# EAGLE design main1-rev-b (EAGLE 8.0.0)
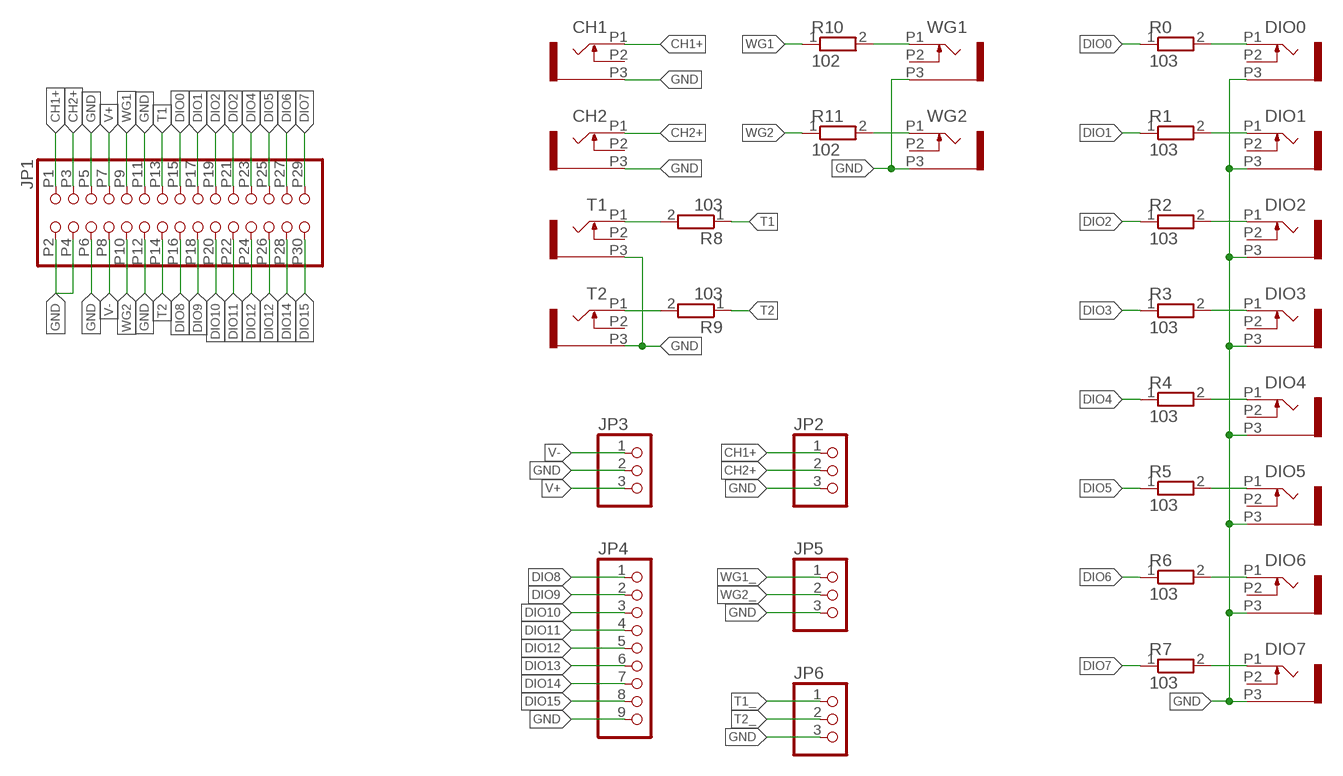
[diagram p0: schematic, sheet 1]

## Parts
CH1  THONKICONN  [WQP-PJ301M-12_JACK]
CH2  THONKICONN  [WQP-PJ301M-12_JACK]
DIO0  THONKICONN  [WQP-PJ301M-12_JACK]
DIO1  THONKICONN  [WQP-PJ301M-12_JACK]
DIO2  THONKICONN  [WQP-PJ301M-12_JACK]
DIO3  THONKICONN  [WQP-PJ301M-12_JACK]
DIO4  THONKICONN  [WQP-PJ301M-12_JACK]
DIO5  THONKICONN  [WQP-PJ301M-12_JACK]
DIO6  THONKICONN  [WQP-PJ301M-12_JACK]
DIO7  THONKICONN  [WQP-PJ301M-12_JACK]
JP1  PINHD-2X15  [2X15/EDGE]
JP2  PINHD-1X3/OCT  [1X03/OCT]
JP3  PINHD-1X3/OCT  [1X03/OCT]
JP4  PINHD-1X9/OCT  [1X09/OCT]
JP5  PINHD-1X3/OCT  [1X03/OCT]
JP6  PINHD-1X3/OCT  [1X03/OCT]
R0  103  R-EU_R0603  [R0603]
R1  103  R-EU_R0603  [R0603]
R2  103  R-EU_R0603  [R0603]
R3  103  R-EU_R0603  [R0603]
R4  103  R-EU_R0603  [R0603]
R5  103  R-EU_R0603  [R0603]
R6  103  R-EU_R0603  [R0603]
R7  103  R-EU_R0603  [R0603]
R8  103  R-EU_R0603  [R0603]
R9  103  R-EU_R0603  [R0603]
R10  102  R-EU_R0603  [R0603]
R11  102  R-EU_R0603  [R0603]
T1  THONKICONN  [WQP-PJ301M-12_JACK]
T2  THONKICONN  [WQP-PJ301M-12_JACK]
WG1  THONKICONN  [WQP-PJ301M-12_JACK]
WG2  THONKICONN  [WQP-PJ301M-12_JACK]

## Nets
CH1+: CH1.P1 JP1.P1 JP2.1
CH2+: CH2.P1 JP1.P3 JP2.2
DIO0: JP1.P15 R0.1
DIO0_: DIO0.P1 R0.2
DIO1: JP1.P17 R1.1
DIO1_: DIO1.P1 R1.2
DIO2: JP1.P19 R2.1
DIO2_: DIO2.P1 R2.2
DIO3: JP1.P21 R3.1
DIO3_: DIO3.P1 R3.2
DIO4: JP1.P23 R4.1
DIO4_: DIO4.P1 R4.2
DIO5: JP1.P25 R5.1
DIO5_: DIO5.P1 R5.2
DIO6: JP1.P27 R6.1
DIO6_: DIO6.P1 R6.2
DIO7: JP1.P29 R7.1
DIO7_: DIO7.P1 R7.2
DIO8: JP1.P16 JP4.1
DIO9: JP1.P18 JP4.2
DIO10: JP1.P20 JP4.3
DIO11: JP1.P22 JP4.4
DIO12: JP1.P24 JP4.5
DIO13: JP1.P26 JP4.6
DIO14: JP1.P28 JP4.7
DIO15: JP1.P30 JP4.8
GND: CH1.P3 CH2.P3 DIO0.P3 DIO1.P3 DIO2.P3 DIO3.P3 DIO4.P3 DIO5.P3 DIO6.P3 DIO7.P3 JP1.P2 JP1.P4 JP1.P5 JP1.P6 JP1.P11 JP1.P12 JP2.3 JP3.2 JP4.9 JP5.3 JP6.3 T1.P3 T2.P3 WG1.P3 WG2.P3
T1: JP1.P13 R8.1
T1_: JP6.1 R8.2 T1.P1
T2: JP1.P14 R9.1
T2_: JP6.2 R9.2 T2.P1
V+: JP1.P7 JP3.3
V-: JP1.P8 JP3.1
WG1: JP1.P9 R10.1
WG1_: JP5.1 R10.2 WG1.P1
WG2: JP1.P10 R11.1
WG2_: JP5.2 R11.2 WG2.P1
Unconnected: CH1.P2 CH2.P2 DIO0.P2 DIO1.P2 DIO2.P2 DIO3.P2 DIO4.P2 DIO5.P2 DIO6.P2 DIO7.P2 T1.P2 T2.P2 WG1.P2 WG2.P2

## Library data of the parts
CH1 CH2 DIO0 DIO1-DIO7 T1 T2 WG1 WG2 = _JC:THONKICONN
JP1 = _JC:PINHD-2X15: PIN HEADER
JP2 JP3 JP5 JP6 = _JC:PINHD-1X3: PIN HEADER
JP4 = _JC:PINHD-1X9: PIN HEADER
R0 R1-R11 = _JC:R-EU_: RESISTOR, European symbol

## Board
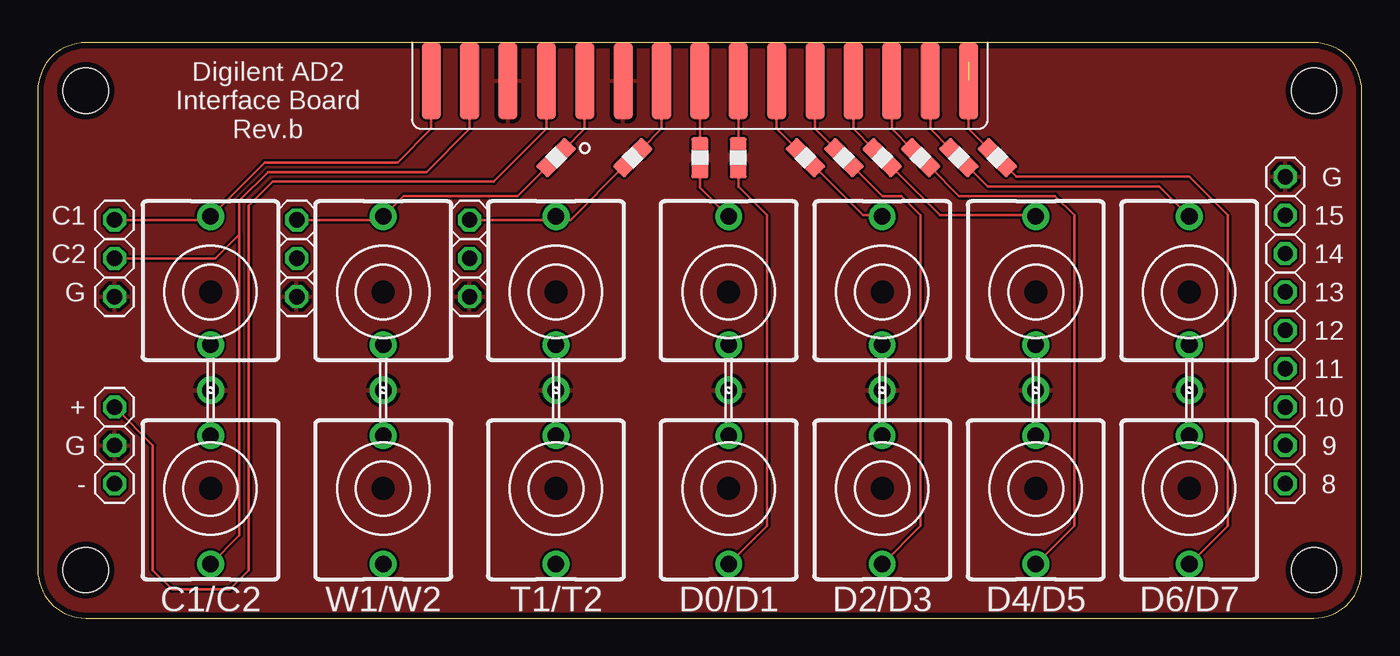
[diagram p1: board, top side]
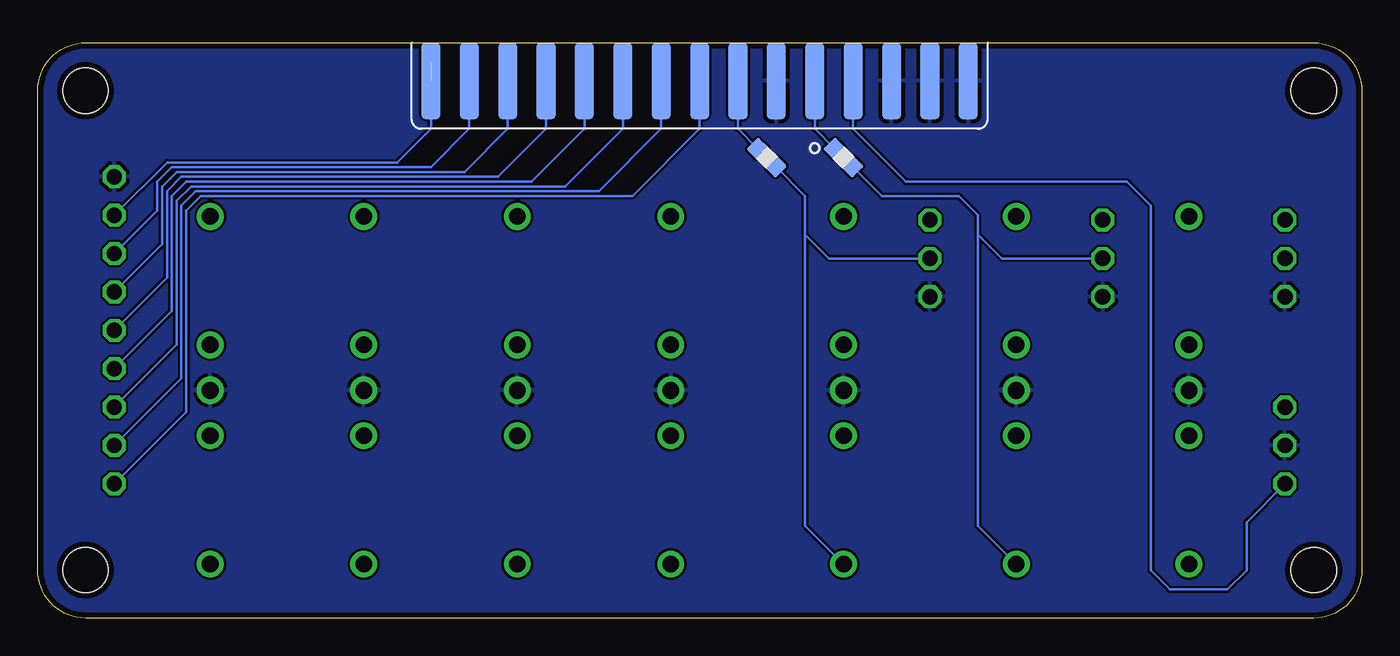
[diagram p2: board, bottom side, seen from below]

Size 87.61 x 38.09 mm. Coordinates in mm from the lower left corner, seen from the top.
Outline: 3.17,0 84.44,0 arc90 87.61,3.18 87.61,34.91 arc90 84.44,38.09 3.17,38.09 arc90 0,34.91 0,3.18 arc90 3.17,0
Copper layers (1*16): Top 0.0356mm / dielectric 1.5011mm / Bottom 0.0356mm
Design rules "oshpark-2layer": minimum track width 6mil, minimum drill 13mil, track to track 6mil, track to pad 6mil, pad to pad 6mil, via to via 6mil, smd to smd 6mil, copper to edge 15mil, drill to drill 6mil, minimum pad ring 7mil, minimum via ring 7mil, stop-mask expansion 2.5mil, vias tented up to drill 0mil, thermal gap 10mil

### Footprints (pad centres in the part's own frame; a part is rotated, then mirrored left to right if it is on the bottom)
WQP-PJ301M-12_JACK = drill 1.1 pad 1.778: P1 0,5; P2 0,-3.5; P3 0,-6.5
2X15/EDGE = smd 1.27 x 5.08: P1 -17.78,-2.54; P3 -15.24,-2.54; P5 -12.7,-2.54; P7 -10.16,-2.54; P9 -7.62,-2.54; P11 -5.08,-2.54; P13 -2.54,-2.54; P15 0,-2.54; P17 2.54,-2.54; P19 5.08,-2.54; P21 7.62,-2.54; P23 10.16,-2.54; P25 12.7,-2.54; P27 15.24,-2.54; P29 17.78,-2.54 | smd 1.27 x 5.08 bottom: P2 -17.78,-2.54; P4 -15.24,-2.54; P6 -12.7,-2.54; P8 -10.16,-2.54; P10 -7.62,-2.54; P12 -5.08,-2.54; P14 -2.54,-2.54; P16 0,-2.54; P18 2.54,-2.54; P20 5.08,-2.54; P22 7.62,-2.54; P24 10.16,-2.54; P26 12.7,-2.54; P28 15.24,-2.54; P30 17.78,-2.54
1X03/OCT = drill 1.016 octagon: 1 -2.54,0; 2 0,0; 3 2.54,0
1X09/OCT = drill 1.016 octagon: 1 -10.16,0; 2 -7.62,0; 3 -5.08,0; 4 -2.54,0; 5 0,0; 6 2.54,0; 7 5.08,0; 8 7.62,0; 9 10.16,0
R0603 = smd 1 x 1.1: 1 -0.85,0; 2 0.85,0
HOLE_3MM = hole 3: 0,0

### Placement (x,y rotation side)
CH1  11.43,21.59 0 top
CH2  11.43,8.57 180 top
DIO0  45.72,21.59 0 top
DIO1  45.72,8.57 180 top
DIO2  55.88,21.59 0 top
DIO3  55.88,8.57 180 top
DIO4  66.04,21.59 0 top
DIO5  66.04,8.57 180 top
DIO6  76.2,21.59 0 top
DIO7  76.2,8.57 180 top
JP1  43.81,38.1 0 top
JP2  5.08,23.81 270 top
JP3  5.08,11.43 90 top
JP4  82.55,19.05 90 top
JP5  17.14,23.81 270 top
JP6  28.57,23.81 270 top
R0  43.81,30.48 270 top
R1  46.35,30.48 270 top
R2  50.8,30.48 315 top
R3  53.34,30.48 315 top
R4  55.88,30.48 315 top
R5  58.42,30.48 315 top
R6  60.96,30.48 315 top
R7  63.5,30.48 315 top
R8  39.37,30.48 225 top
R9  39.37,30.48 315 bottom
R10  34.29,30.48 225 top
R11  34.29,30.48 315 bottom
T1  34.29,21.59 0 top
T2  34.29,8.57 180 top
U$1  [HOLE_3MM]  3.17,3.18 0 top
U$2  [HOLE_3MM]  3.17,34.92 0 top
U$3  [HOLE_3MM]  84.45,34.92 0 top
U$4  [HOLE_3MM]  84.45,3.18 0 top
WG1  22.86,21.59 0 top
WG2  22.86,8.57 180 top

### Tracks (layer width: path | path; a pad name or v marks a point on that pad's centre or on a via)
CH1+
  Top 0.152: JP1.P1 26.04,32.39 23.81,30.16 15,30.16 CH1.P1 11.19,26.35 JP2.1
CH2+
  Top 0.152: JP1.P3 28.57,32.39 25.72,29.53 15.24,29.53 13.34,27.62 13.34,25.4 | 13.34,25.4 13.34,5.48 CH2.P1 | JP2.2 11.75,23.81 13.34,25.4
DIO0
  Top 0.152: 43.81,36.83 JP1.P15 R0.1
DIO0_
  Top 0.152: R0.2 43.81,28.5 DIO0.P1
DIO1
  Top 0.152: JP1.P17 R1.1
DIO1_
  Top 0.152: R1.2 46.35,28.58 48.26,26.67 48.26,6.11 DIO1.P1
DIO2
  Top 0.152: JP1.P19 48.9,32.39 R2.1
DIO2_
  Top 0.152: R2.2 | R2.2 54.61,26.67 55.8,26.67 DIO2.P1
DIO3
  Top 0.152: JP1.P21 51.44,32.39 R3.1
DIO3_
  Top 0.152: R3.2 | R3.2 55.88,27.94 57.15,27.94 58.42,26.67 58.42,6.11 DIO3.P1
DIO4
  Top 0.152: JP1.P23 53.98,32.39 R4.1
DIO4_
  Top 0.152: R4.2 | R4.2 59.69,26.67 65.96,26.67 DIO4.P1
DIO5
  Top 0.152: JP1.P25 56.52,32.39 R5.1
DIO5_
  Top 0.152: R5.2 | R5.2 60.96,27.94 67.31,27.94 68.58,26.67 68.58,6.11 DIO5.P1
DIO6
  Top 0.152: JP1.P27 59.05,32.39 R6.1
DIO6_
  Top 0.152: R6.2 | DIO6.P1 74.22,28.58 62.87,28.58 R6.2
DIO7
  Top 0.152: JP1.P29 61.59,32.39 R7.1
DIO7_
  Top 0.152: R7.2 | R7.2 64.77,29.21 76.2,29.21 78.74,26.67 78.74,6.11 DIO7.P1
DIO8
  Bottom 0.152: JP4.1 77.79,13.65 77.79,26.99 76.83,27.94 48.26,27.94 43.81,32.39 JP1.P16
DIO9
  Bottom 0.152: JP4.2 78.11,15.88 78.11,27.31 77.15,28.26 50.48,28.26 46.35,32.39 JP1.P18
DIO10
  Bottom 0.152: JP4.3 78.42,18.1 78.42,27.62 77.47,28.58 52.7,28.58 48.9,32.39 JP1.P20
DIO11
  Bottom 0.152: JP4.4 78.74,20.32 78.74,27.94 77.79,28.89 54.93,28.89 51.44,32.39 JP1.P22
DIO12
  Bottom 0.152: JP4.5 79.06,22.54 79.06,28.26 78.11,29.21 57.15,29.21 53.98,32.39 JP1.P24
DIO13
  Bottom 0.152: JP4.6 79.38,24.77 79.38,28.58 78.42,29.53 59.37,29.53 56.52,32.39 JP1.P26
DIO14
  Bottom 0.152: JP4.7 79.69,26.99 79.69,28.89 78.74,29.84 61.59,29.84 59.05,32.39 JP1.P28
DIO15  (1 unrouted)
  Bottom 0.152: JP4.8 79.06,30.16 63.82,30.16 61.59,32.39 61.59,36.83
GND
  pour Bottom: -1.27,40.64 90.17,40.64 90.17,-5.08 -2.54,-5.08 -2.54,40.64
  pour Top: -1.27,39.37 88.9,39.37 88.9,-3.81 -1.27,-3.81
T1
  Top 0.152: JP1.P13 41.27,32.39 R8.1
T1_
  Top 0.152: R8.2 35.24,26.35 34.53,26.35 T1.P1 34.05,26.35 JP6.1
T2
  Bottom 0.152: JP1.P14 41.27,32.39 R9.1
T2_
  Bottom 0.152: R9.2 36.83,27.94 36.83,25.4 | T2.P1 36.83,6.11 36.83,25.4 | JP6.2 35.24,23.81 36.83,25.4
V+
  Top 0.152: JP1.P7 33.66,32.39 30.16,28.89 15.56,28.89 13.97,27.31 13.97,3.18 12.7,1.91 8.89,1.91 7.62,3.18 7.62,11.43 JP3.3
V-
  Bottom 0.152: JP1.P8 33.66,32.39 30.16,28.89 15.56,28.89 13.97,27.31 13.97,3.18 12.7,1.91 8.89,1.91 7.62,3.18 7.62,6.35 JP3.1
WG1
  Top 0.152: JP1.P9 36.2,32.39 R10.1
WG1_
  Top 0.152: R10.2 31.75,27.94 24.21,27.94 WG1.P1 22.62,26.35 JP5.1
WG2
  Bottom 0.152: JP1.P10 36.2,32.39 R11.1
WG2_
  Bottom 0.152: R11.2 | R11.2 31.75,27.94 26.67,27.94 25.4,26.67 25.4,25.4 | 25.4,25.4 25.4,6.11 WG2.P1 | JP5.2 23.81,23.81 25.4,25.4

### Text on the board
tPlace: Digilent AD2 / Interface Board / Rev.b
tNames: G | C1 | 15 | C2 | 14 | G | 13 | 12 | 11 | + | 10 | G | 9 | - | 8 | C1/C2 | W1/W2 | T1/T2 | D0/D1 | D2/D3 | D4/D5 | D6/D7